# EAGLE design 808_output (EAGLE 7.2.0)
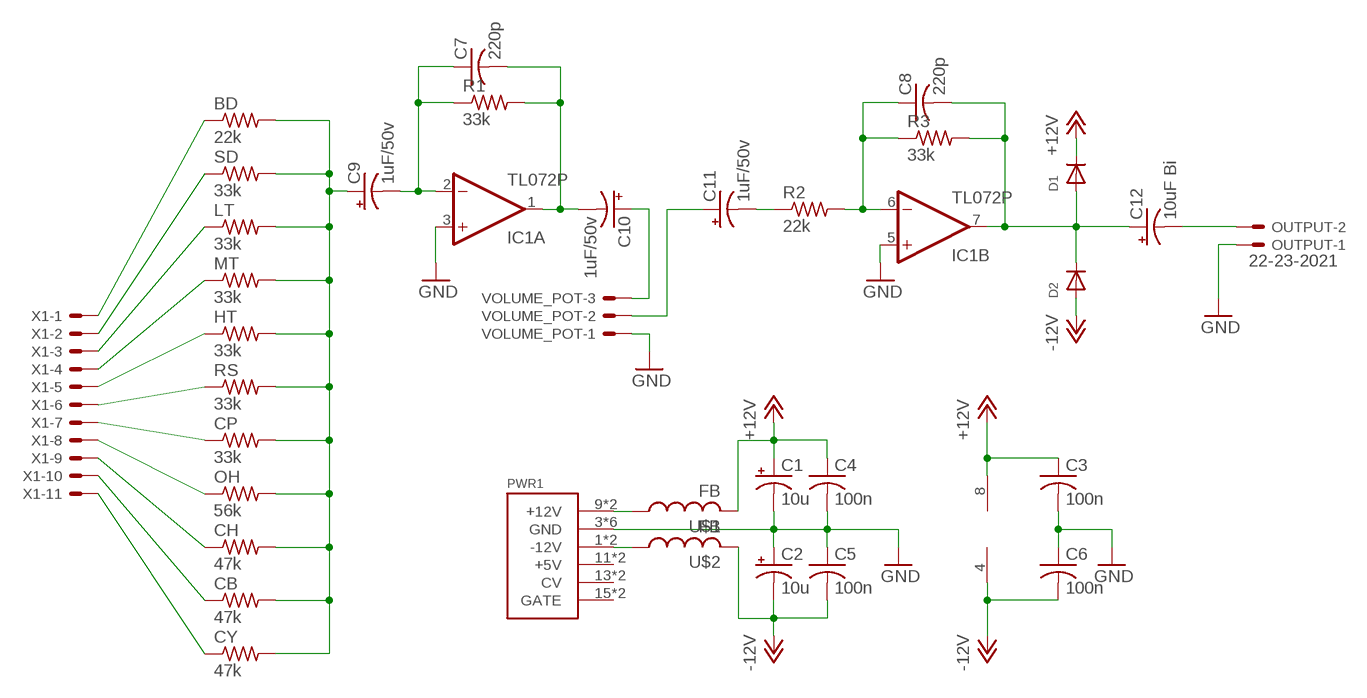
[diagram p0: schematic, sheet 1]

## Parts
BD  22k  R-US_0207/5V  [0207/5V]
C1  10u  CPOL-USB45181A  [B45181A]
C2  10u  CPOL-USB45181A  [B45181A]
C3  100n  C-US050-024X044  [C050-024X044]
C4  100n  C-US050-024X044  [C050-024X044]
C5  100n  C-US050-024X044  [C050-024X044]
C6  100n  C-US050-024X044  [C050-024X044]
C7  220p  C-US025-025X050  [C025-025X050]
C8  220p  C-US025-025X050  [C025-025X050]
C9  1uF/50v  CPOL-USB45181A  [B45181A]
C10  1uF/50v  CPOL-USB45181A  [B45181A]
C11  1uF/50v  CPOL-USB45181A  [B45181A]
C12  10uF Bi  CPOL-USB45181A  [B45181A]
CB  47k  R-US_0207/5V  [0207/5V]
CH  47k  R-US_0207/5V  [0207/5V]
CP  33k  R-US_0207/5V  [0207/5V]
CY  47k  R-US_0207/5V  [0207/5V]
D1  DIODEDO-1N4148  [DO-1N4148]
D2  DIODEDO-1N4148  [DO-1N4148]
HT  33k  R-US_0207/5V  [0207/5V]
IC1  TL072P  [DIL08]
LT  33k  R-US_0207/5V  [0207/5V]
MT  33k  R-US_0207/5V  [0207/5V]
OH  56k  R-US_0207/5V  [0207/5V]
OUTPUT  22-23-2021  [22-23-2021]
PWR1  POWER  [POWER_16]
R1  33k  R-US_0207/7  [0207/7]
R2  22k  R-US_0207/7  [0207/7]
R3  33k  R-US_0207/7  [0207/7]
RS  33k  R-US_0207/5V  [0207/5V]
SD  33k  R-US_0207/5V  [0207/5V]
U$1  FB  [FB]
U$2  FB  [FB]
VOLUME_POT  KK-156-3  [KK-156-3]
X1  KK-156-11  [KK-156-11]

## Nets
+12V: C1.+ C3.1 C4.1 D1.C IC1.8(P:V+) U$1.P$2
-12V: C2.- C5.2 C6.2 D2.A IC1.4(P:V-) U$2.P$2
GND: C1.- C2.+ C3.2 C4.2 C5.1 C6.1 IC1.3(A:+IN) IC1.5(B:+IN) OUTPUT.1 PWR1.3(GND) PWR1.4(GND) PWR1.5(GND) PWR1.6(GND) PWR1.7(GND) PWR1.8(GND) VOLUME_POT.1
N$1: PWR1.9(+12V) PWR1.10(+12V) U$1.P$1
N$2: PWR1.1(-12V) PWR1.2(-12V) U$2.P$1
N$3: BD.1 X1.1
N$4: SD.1 X1.2
N$5: LT.1 X1.3
N$6: MT.1 X1.4
N$7: HT.1 X1.5
N$8: RS.1 X1.6
N$9: CP.1 X1.7
N$10: OH.1 X1.8
N$11: CH.1 X1.9
N$12: CB.1 X1.10
N$13: CY.1 X1.11
N$14: BD.2 C9.+ CB.2 CH.2 CP.2 CY.2 HT.2 LT.2 MT.2 OH.2 RS.2 SD.2
N$15: C7.2 C10.- IC1.1(A:OUT) R1.2
N$16: C8.1 IC1.6(B:-IN) R2.2 R3.1
N$17: C7.1 C9.- IC1.2(A:-IN) R1.1
N$18: C11.- R2.1
N$19: C8.2 C12.+ D1.A D2.C IC1.7(B:OUT) R3.2
N$20: C10.+ VOLUME_POT.3
N$21: C11.+ VOLUME_POT.2
N$22: C12.- OUTPUT.2
Unconnected: PWR1.11(+5V) PWR1.12(+5V) PWR1.13(CV) PWR1.14(CV) PWR1.15(GATE) PWR1.16(GATE)

## Library data of the parts
BD CB CH CP CY HT LT MT OH R1-R3 RS SD = rcl:R-US_: RESISTOR, American symbol
C1 C2 C9-C12 = rcl:CPOL-US: POLARIZED CAPACITOR, American symbol
C3-C8 = rcl:C-US: CAPACITOR, American symbol
D1 D2 = 808_lt:DIODE: Diode SMADIODE - SMA Surface Mount Package 20V 1A Schottky Diode Digikey: 641-1014-6-ND DO-1N4148 - Through Hole Small Current Diode SOD-123 20V 1 A (.5mV Vf) Schottky Diode - Digikey: MBRX120TPMSCT-ND SOD-323 10V 570mA (.38mV Vf, 3ns) Schottky Diode - Digikey: ZLLS410CT-ND SOD-523 30V 30mA Schottky Diode (RB751S-40TE61) - Digikey: RB751S-40TE61CT-ND SOT23-R/W - SOT23 Package (R = Solder Paste/Reflow Ovens, W = Hand-Soldering) BAT54Film 40V 300mA - Digikey: 497-7162-1-ND
IC1 = linear:TL072: OP AMP
OUTPUT = con-molex:22-23-2021: .100" (2.54mm) Center Header - 2 Pin; MF: MOLEX; MPN: 22-23-2021; OC_FARNELL: 1462926; OC_NEWARK: 25C3832
PWR1 = eurorack:POWER
U$1 U$2 = adafruit:FB: Ferrite bead Digikey #P9821BK-ND
VOLUME_POT = con-molex:KK-156-3: KK 156 HEADER Source: http://www.molex.com/pdm_docs/sd/026604100_sd.pdf; OC_FARNELL: unknown; OC_NEWARK: unknown
X1 = con-molex:KK-156-11: KK 156 HEADER Source: http://www.molex.com/pdm_docs/sd/026604100_sd.pdf; OC_FARNELL: unknown; OC_NEWARK: unknown

## Net classes
0 default: width 0.635 mm, drill 0.254 mm, clearance 0.254 mm
1 GND: width 1.016 mm, drill 1.016 mm, clearance 0.508 mm

## Board
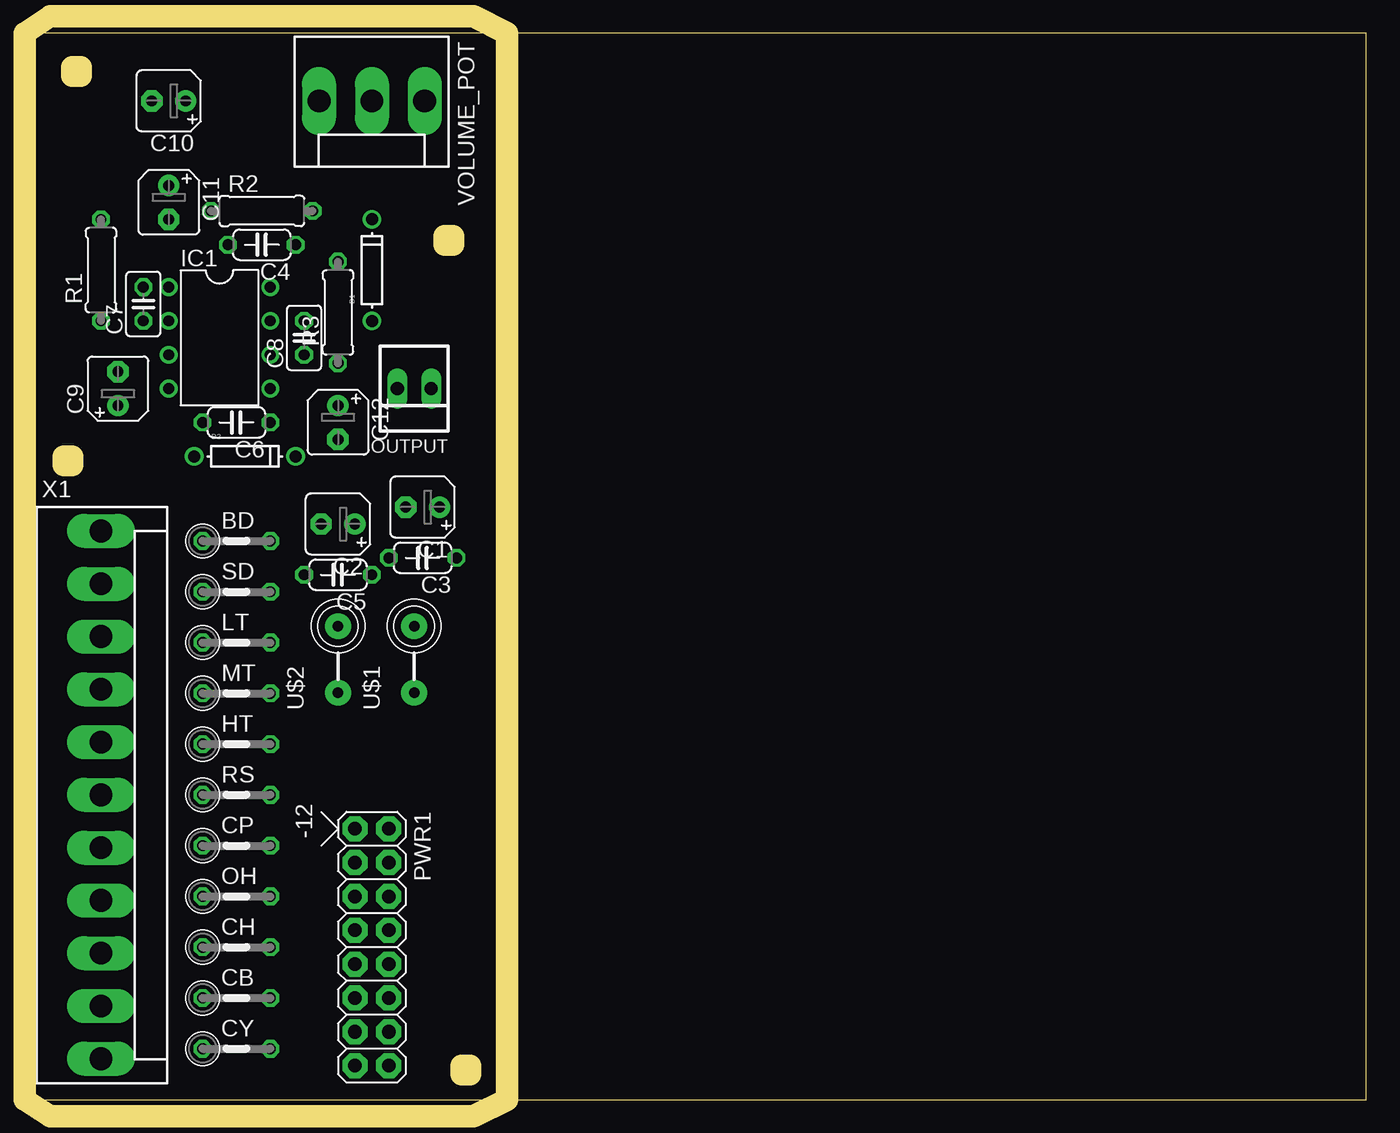
[diagram p1: board, top side]
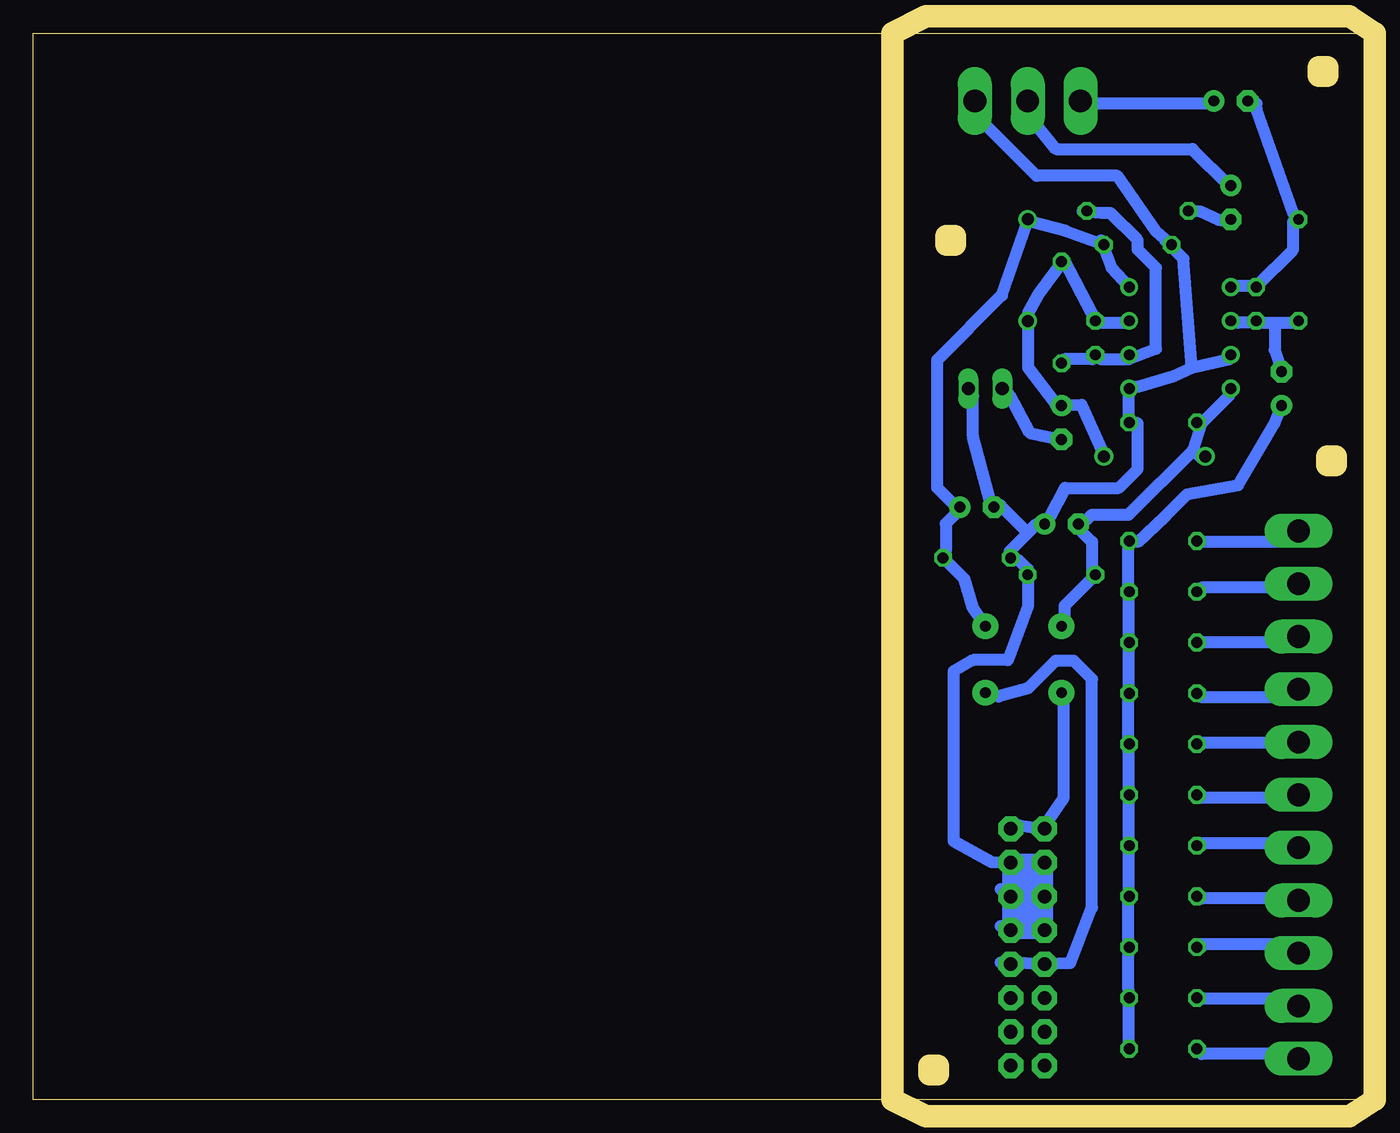
[diagram p2: board, bottom side, seen from below]

Size 100 x 80 mm. Coordinates in mm from the lower left corner, seen from the top.
Outline: 0,0 100,0 100,80 0,80 0,0
Copper layers (1*16): Top 0.035mm / dielectric 1.5mm / Bottom 0.035mm
Design rules "default *": minimum track width 36mil, minimum drill 32mil, track to track 18mil, track to pad 18mil, pad to pad 18mil, via to via 18mil, smd to smd 8mil, copper to edge 0mil, drill to drill 18mil, minimum pad ring 10mil, minimum via ring 8mil, stop-mask expansion 4mil, vias tented up to drill 0mil, thermal gap 10mil
Milling: 24 lines

### Footprints (pad centres in the part's own frame; a part is rotated, then mirrored left to right if it is on the bottom)
0207/5V = drill 0.813 octagon: 1 -2.54,0; 2 2.54,0
B45181A = drill 0.813 pad 1.6: + -1.27,0 | drill 0.813 pad 1.6 octagon: - 1.27,0
C050-024X044 = drill 0.813 octagon: 1 -2.54,0; 2 2.54,0
C025-025X050 = drill 0.813 octagon: 1 -1.27,0; 2 1.27,0
DO-1N4148 = drill 0.9: A -3.81,0; C 3.81,0
DIL08 = drill 0.813 pad 1.27: 1 -3.81,-3.81; 2 -1.27,-3.81; 3 1.27,-3.81; 4 3.81,-3.81; 5 3.81,3.81; 6 1.27,3.81; 7 -1.27,3.81; 8 -3.81,3.81
22-23-2021 = drill 1 long: 1 -1.27,0; 2 1.27,0
POWER_16 = drill 1.016 pad 1.88 octagon: 1 -6.35,-1.27; 2 -6.35,1.27; 3 -3.81,-1.27; 4 -3.81,1.27; 5 -1.27,-1.27; 6 -1.27,1.27; 7 1.27,-1.27; 8 1.27,1.27; 9 3.81,-1.27; 10 3.81,1.27; 11 6.35,-1.27; 12 6.35,1.27; 13 8.89,-1.27; 14 8.89,1.27; 15 11.43,-1.27; 16 11.43,1.27
0207/7 = drill 0.813 octagon: 1 -3.81,0; 2 3.81,0
FB = drill 0.8 pad 1.93: P$1 -2.5,0; P$2 2.5,0
KK-156-3 = drill 1.7 pad 2.184 long: 1 -3.96,0; 2 0,0; 3 3.96,0
KK-156-11 = drill 1.7 pad 2.184 long: 1 -19.8,0; 2 -15.84,0; 3 -11.88,0; 4 -7.92,0; 5 -3.96,0; 6 0,0; 7 3.96,0; 8 7.92,0; 9 11.88,0; 10 15.84,0; 11 19.8,0

### Placement (x,y rotation side)
BD  15.24,41.91 0 top
C1  29.21,44.45 180 top
C2  22.86,43.18 180 top
C3  29.21,40.64 180 top
C4  17.14,64.14 180 top
C5  22.86,39.37 180 top
C6  15.24,50.8 180 top
C7  8.26,59.69 90 top
C8  20.32,57.15 90 top
C9  6.35,53.34 90 top
C10  10.16,74.93 180 top
C11  10.16,67.31 270 top
C12  22.86,50.8 270 top
CB  15.24,7.62 0 top
CH  15.24,11.43 0 top
CP  15.24,19.05 0 top
CY  15.24,3.81 0 top
D1  25.4,62.23 90 top
D2  15.88,48.26 0 top
HT  15.24,26.67 0 top
IC1  13.97,57.15 270 top
LT  15.24,34.29 0 top
MT  15.24,30.48 0 top
OH  15.24,15.24 0 top
OUTPUT  28.57,53.34 180 top
PWR1  25.4,13.97 270 top
R1  5.08,62.23 90 top
R2  17.14,66.67 0 top
R3  22.86,59.05 90 top
RS  15.24,22.86 0 top
SD  15.24,38.1 0 top
U$1  28.57,33.02 90 top
U$2  22.86,33.02 90 top
VOLUME_POT  25.4,74.93 180 top
X1  5.08,22.86 270 top

### Tracks (layer width: path | path; a pad name or v marks a point on that pad's centre or on a via)
+12V
  Bottom 0.914: IC1.8 17.83,61.04 19.1,62.41 19.89,64.47 C4.1 22.48,65.15 25.07,65.84 25.38,65.84 D1.C 25.43,65.84 27.33,60.35 32.18,55.5 32.18,45.9 30.86,44.58 C1.+ 30.86,43.89 31.55,43.2 31.55,41.15 C3.1 31.55,40.46 30.18,39.09 29.54,36.93 U$1.P$2
-12V
  Bottom 0.914: 12.98,48.74 12.34,50.75 | 12.98,48.74 12.29,48.06 D2.A | 12.34,50.75 10.29,52.81 IC1.4 | 12.34,50.75 C6.2 | U$2.P$2 22.63,35.66 22.63,37.03 20.57,39.09 C5.2 20.57,39.78 20.57,41.83 21.26,42.52 C2.- 21.26,43.2 20.57,43.89 17.83,43.89 12.98,48.74
GND
  Bottom 0.914: 13.08,54.91 14.45,54.28 17.14,53.49 IC1.5 17.83,52.81 17.83,51.44 C6.1 17.14,50.75 17.14,47.32 18.57,45.9 22.58,45.9 24,43.2 C2.+ 24.69,43.2 25.38,42.52 | 13.08,54.91 10.29,55.55 IC1.3 | 13.08,54.91 13.72,63.09 15.09,64.47 C4.2 15.77,65.15 18.67,69.32 24.74,69.32 28.8,73.38 28.8,74.75 VOLUME_POT.1 | PWR1.8 27.43,13.03 26.06,13.03 PWR1.7 24.11,13.03 24.11,15.09 PWR1.5 | PWR1.5 24.11,15.77 24.11,17.14 PWR1.3 | PWR1.5 26.06,15.77 27.43,15.77 PWR1.6 26.85,15.14 26.85,17.14 PWR1.4 28.12,17.83 30.96,19.41 30.96,32.13 29.49,32.97 26.9,32.97 25.38,37.03 25.38,39.09 C5.1 25.38,39.78 26.06,40.46 C3.2 26.75,41.15 25.38,42.52 | OUTPUT.1 29.49,52.81 29.49,49.76 28.12,44.58 C1.- 27.43,44.58 25.38,42.52
N$1
  Bottom 0.914: PWR1.10 27.43,10.29 26.06,10.29 PWR1.9 22.2,10.24 20.57,14.4 20.57,31.55 21.95,32.92 23.32,32.92 25.38,30.86 27.58,30.23 U$1.P$1
N$2
  Bottom 0.914: PWR1.2 26.16,20.57 26.06,20.57 PWR1.1 24.11,20.57 22.68,22.63 22.68,30.18 U$2.P$1
N$3
  Bottom 0.914: BD.1 12.34,41.83 6.17,41.83 5.49,42.52 X1.1
N$4
  Bottom 0.914: SD.1 12.34,38.41 5.49,38.41 X1.2
N$5
  Bottom 0.914: LT.1 5.49,34.29 X1.3
N$6
  Bottom 0.914: MT.1 12.34,30.18 5.49,30.18 X1.4
N$7
  Bottom 0.914: HT.1 12.34,26.75 5.49,26.75 X1.5
N$8
  Bottom 0.914: RS.1 12.34,22.63 5.49,22.63 X1.6
N$9
  Bottom 0.914: CP.1 12.34,19.2 5.49,19.2 X1.7
N$10
  Bottom 0.914: OH.1 12.34,15.09 5.49,15.09 X1.8
N$11
  Bottom 0.914: CH.1 12.34,11.66 5.49,11.66 X1.9
N$12
  Bottom 0.914: CB.1 12.34,7.54 5.49,7.54 X1.10
N$13
  Bottom 0.914: CY.1 12.34,3.43 5.49,3.43 X1.11
N$14
  Bottom 0.914: CY.2 17.83,4.12 17.83,7.54 CB.2 17.83,8.23 17.83,10.97 CH.2 17.83,11.66 17.83,15.09 OH.2 17.83,15.77 17.83,18.52 CP.2 17.83,19.2 17.83,22.63 RS.2 17.83,23.32 17.83,26.06 HT.2 17.83,26.75 17.83,30.18 MT.2 17.83,30.86 17.83,34.29 | 17.83,34.29 17.83,37.72 SD.2 17.83,38.41 17.83,41.83 BD.2 17.14,41.83 15.09,43.74 13.41,45.41 9.6,46.1 6.86,50.75 C9.+ | 17.83,34.29 LT.2
N$15
  Bottom 0.914: 8.23,61.04 5.49,63.78 5.49,65.84 R1.2 5.49,66.52 8.23,74.35 8.23,74.75 C10.- | 8.23,61.04 9.6,61.04 IC1.1 | 8.23,61.04 C7.2
N$16
  Bottom 0.914: 17.83,55.55 19.89,55.55 C8.1 20.57,55.55 22.63,55.55 R3.1 | 17.83,55.55 15.77,56.34 15.77,62.41 17.14,63.78 17.14,64.47 19.2,66.52 19.89,66.52 21.26,66.62 R2.2 | 17.83,55.55 IC1.6
N$17
  Bottom 0.914: 8.23,58.29 6.86,58.29 | 6.86,58.29 5.49,58.29 R1.1 | 6.86,58.29 6.86,56.24 C9.- | 8.23,58.29 9.6,58.29 IC1.2 | 8.23,58.29 C7.1
N$18
  Bottom 0.914: R2.1 12.45,66.62 11.07,65.99 10.29,65.84 C11.-
N$19
  Bottom 0.914: D2.C 19.84,48.69 21.36,52.12 C12.+ 23.32,52.12 23.32,52.22 25.38,54.91 25.38,58.29 D1.A 25.38,58.98 24.59,60.4 22.68,62.99 | IC1.7 17.83,58.29 19.89,58.29 C8.2 20.57,58.98 22.68,62.99 | 22.68,62.99 22.68,63.09 R3.2
N$20
  Bottom 0.914: C10.+ 11.66,74.75 21.26,74.75 VOLUME_POT.3
N$21
  Bottom 0.914: C11.+ 10.29,68.58 13.03,71.32 23.27,71.32 26.06,74.75 VOLUME_POT.2
N$22
  Bottom 0.914: OUTPUT.2 26.75,52.81 25.22,50.01 C12.-
(copper drawn outside any net)
  shapes: Bottom area x1